# EAGLE design Massage_Pad_Peripheral_PCB_SplitPlane (EAGLE 9.3.1)
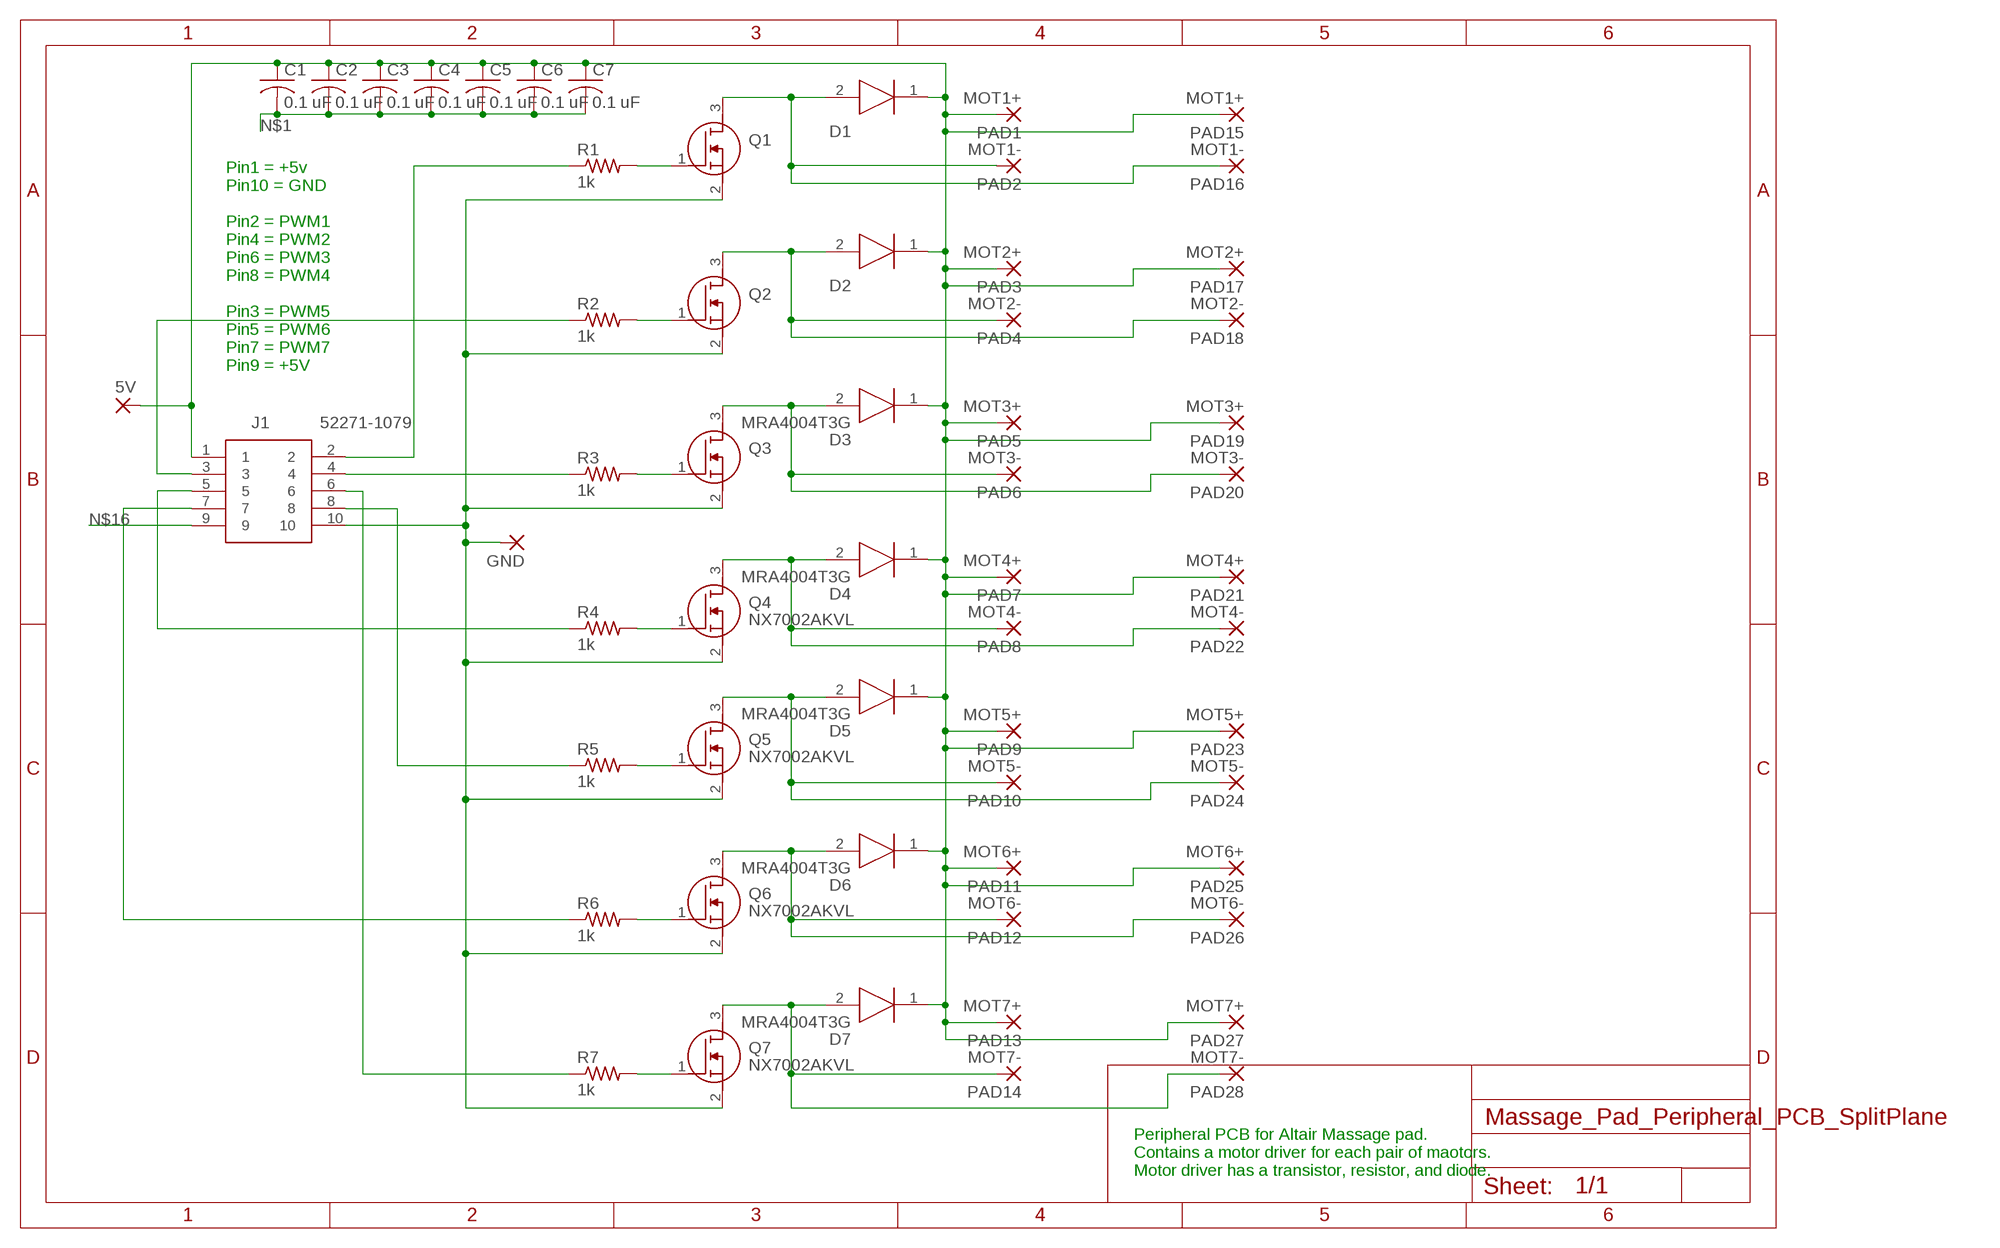
[diagram p0: schematic, sheet 1]

## Parts
5V  3,17/1,3  [3,17/1,3]
C1  0.1 uF  C-USC1808  [C1808]
C2  0.1 uF  C-USC1808  [C1808]
C3  0.1 uF  C-USC1808  [C1808]
C4  0.1 uF  C-USC1808  [C1808]
C5  0.1 uF  C-USC1808  [C1808]
C6  0.1 uF  C-USC1808  [C1808]
C7  0.1 uF  C-USC1808  [C1808]
D1  MRA4004T3G  [DIOM5226X220N]
D2  MRA4004T3G  [DIOM5226X220N]
D3  MRA4004T3G  [DIOM5226X220N]
D4  MRA4004T3G  [DIOM5226X220N]
D5  MRA4004T3G  [DIOM5226X220N]
D6  MRA4004T3G  [DIOM5226X220N]
D7  MRA4004T3G  [DIOM5226X220N]
GND  3,17/1,3  [3,17/1,3]
J1  52271-1079  [52271-1079]
PAD1  MOT1+  WIREPADSMD5-2,5  [5-2,5]
PAD2  MOT1-  WIREPADSMD5-2,5  [5-2,5]
PAD3  MOT2+  WIREPADSMD5-2,5  [5-2,5]
PAD4  MOT2-  WIREPADSMD5-2,5  [5-2,5]
PAD5  MOT3+  WIREPADSMD5-2,5  [5-2,5]
PAD6  MOT3-  WIREPADSMD5-2,5  [5-2,5]
PAD7  MOT4+  WIREPADSMD5-2,5  [5-2,5]
PAD8  MOT4-  WIREPADSMD5-2,5  [5-2,5]
PAD9  MOT5+  WIREPADSMD5-2,5  [5-2,5]
PAD10  MOT5-  WIREPADSMD5-2,5  [5-2,5]
PAD11  MOT6+  WIREPADSMD5-2,5  [5-2,5]
PAD12  MOT6-  WIREPADSMD5-2,5  [5-2,5]
PAD13  MOT7+  WIREPADSMD5-2,5  [5-2,5]
PAD14  MOT7-  WIREPADSMD5-2,5  [5-2,5]
PAD15  MOT1+  WIREPADSMD5-2,5  [5-2,5]
PAD16  MOT1-  WIREPADSMD5-2,5  [5-2,5]
PAD17  MOT2+  WIREPADSMD5-2,5  [5-2,5]
PAD18  MOT2-  WIREPADSMD5-2,5  [5-2,5]
PAD19  MOT3+  WIREPADSMD5-2,5  [5-2,5]
PAD20  MOT3-  WIREPADSMD5-2,5  [5-2,5]
PAD21  MOT4+  WIREPADSMD5-2,5  [5-2,5]
PAD22  MOT4-  WIREPADSMD5-2,5  [5-2,5]
PAD23  MOT5+  WIREPADSMD5-2,5  [5-2,5]
PAD24  MOT5-  WIREPADSMD5-2,5  [5-2,5]
PAD25  MOT6+  WIREPADSMD5-2,5  [5-2,5]
PAD26  MOT6-  WIREPADSMD5-2,5  [5-2,5]
PAD27  MOT7+  WIREPADSMD5-2,5  [5-2,5]
PAD28  MOT7-  WIREPADSMD5-2,5  [5-2,5]
Q1  NX7002AKVL  [SOT95P230X110-3N]
Q2  NX7002AKVL  [SOT95P230X110-3N]
Q3  NX7002AKVL  [SOT95P230X110-3N]
Q4  NX7002AKVL  [SOT95P230X110-3N]
Q5  NX7002AKVL  [SOT95P230X110-3N]
Q6  NX7002AKVL  [SOT95P230X110-3N]
Q7  NX7002AKVL  [SOT95P230X110-3N]
R1  1k  R-US_R1206  [R1206]
R2  1k  R-US_R1206  [R1206]
R3  1k  R-US_R1206  [R1206]
R4  1k  R-US_R1206  [R1206]
R5  1k  R-US_R1206  [R1206]
R6  1k  R-US_R1206  [R1206]
R7  1k  R-US_R1206  [R1206]

## Nets
N$1: C1.2 C2.2 C3.2 C4.2 C5.2 C6.2 C7.2 GND.1(P) J1.10 Q1.2(S) Q2.2(S) Q3.2(S) Q4.2(S) Q5.2(S) Q6.2(S) Q7.2(S)
N$2: Q1.1(G) R1.2
N$3: Q2.1(G) R2.2
N$4: Q3.1(G) R3.2
N$5: Q4.1(G) R4.2
N$6: Q5.1(G) R5.2
N$7: Q6.1(G) R6.2
N$8: Q7.1(G) R7.2
N$9: D7.2(A) PAD14.1(P) PAD28.1(P) Q7.3(D)
N$10: D6.2(A) PAD12.1(P) PAD26.1(P) Q6.3(D)
N$11: D5.2(A) PAD10.1(P) PAD24.1(P) Q5.3(D)
N$12: D3.2(A) PAD6.1(P) PAD20.1(P) Q3.3(D)
N$13: D4.2(A) PAD8.1(P) PAD22.1(P) Q4.3(D)
N$14: D2.2(A) PAD4.1(P) PAD18.1(P) Q2.3(D)
N$15\: D1.2(A) PAD2.1(P) PAD16.1(P) Q1.3(D)
N$16: 5V.1(P) C1.1 C2.1 C3.1 C4.1 C5.1 C6.1 C7.1 D1.1(K) D2.1(K) D3.1(K) D4.1(K) D5.1(K) D6.1(K) D7.1(K) J1.1 J1.9 PAD1.1(P) PAD3.1(P) PAD5.1(P) PAD7.1(P) PAD9.1(P) PAD11.1(P) PAD13.1(P) PAD15.1(P) PAD17.1(P) PAD19.1(P) PAD21.1(P) PAD23.1(P) PAD25.1(P) PAD27.1(P)
N$17: J1.2 R1.1
N$18: J1.3 R2.1
N$19: J1.4 R3.1
N$20: J1.5 R4.1
N$21: J1.8 R5.1
N$22: J1.7 R6.1
N$24: J1.6 R7.1

## Notes on the sheet
- Pin1 = +5v
  Pin10 = GND
  
  Pin2 = PWM1
  Pin4 = PWM2
  Pin6 = PWM3
  Pin8 = PWM4
  
  Pin3 = PWM5
  Pin5 = PWM6
  Pin7 = PWM7
  Pin9 = +5V
- Peripheral PCB for Altair Massage pad. 
  Contains a motor driver for each pair of maotors.
  Motor driver has a transistor, resistor, and diode.

## Library data of the parts
5V GND = wirepad:3,17/1,3: THROUGH-HOLE PAD
C1-C7 = rcl:C-US: CAPACITOR, American symbol; MANUFACTURER_NAME: Kemet; MANUFACTURER_PART_NUMBER: C1808C104K5RACTU; MOUSER_PART_NUMBER: 80-C1808C104K5R; SPICEPREFIX: C
D1-D7 = MRA4004T3G:MRA4004T3G: Rectifier diode,MRA4004 1A 400V ON Semi MRA4004T3G, SMT Switching Diode, 400V 1A, 2-Pin DO-214AC Source: Datasheet <http://www.onsemi.com/pub/Collateral/MRA4003T3-D.PDF>; ALLIED_NUMBER: 70340468; ALLIED_PRICE-STOCK: http://www.alliedelec.com/on-semiconductor-mra4004t3g/70340468/; DESCRIPTION: Rectifier diode,MRA4004 1A 400V ON Semi MRA4004T3G, SMT Switching Diode, 400V 1A, 2-Pin DO-214AC; HEIGHT: 2.2mm; MANUFACTURER_NAME: ON Semiconductor; MANUFACTURER_PART_NUMBER: MRA4004T3G; MOUSER_PART_NUMBER: 863-MRA4004T3G; MOUSER_PRICE-STOCK: https://www.mouser.com/Search/Refine.aspx?Keyword=863-MRA4004T3G; RS_PART_NUMBER: 6490904; RS_PRICE-STOCK: http://uk.rs-online.com/web/p/products/6490904
J1 = 52271-1079:52271-1079: 1.0MM FPC R/A CONN 10 W Molex FFC/FPC SMT Series 1mm Pitch 10 Way Right Angle SMT Female FPC Connector, ZIF Bottom Contact Source: Datasheet <http://www.molex.com/webdocs/datasheets/pdf/en-us//0522711079_FFC_FPC_CONNECTORS.pdf>; ALLIED_NUMBER: 70373119; ALLIED_PRICE-STOCK: https://www.alliedelec.com/molex-incorporated-52271-1079/70373119/; DESCRIPTION: 1.0MM FPC R/A CONN 10 W Molex FFC/FPC SMT Series 1mm Pitch 10 Way Right Angle SMT Female FPC Connector, ZIF Bottom Contact; HEIGHT: mm; MANUFACTURER_NAME: Molex; MANUFACTURER_PART_NUMBER: 52271-1079; MOUSER_PART_NUMBER: 538-52271-1079; MOUSER_PRICE-STOCK: https://www.mouser.com/Search/Refine.aspx?Keyword=538-52271-1079; RS_PART_NUMBER: 5144329P; RS_PRICE-STOCK: http://uk.rs-online.com/web/p/products/5144329P
PAD1-PAD28 = wirepad:WIREPAD: Wire PAD connect wire on PCB
Q1-Q7 = SamacSys_Parts:NX7002AKVL: Trans MOSFET N-CH 60V 0.19A 3-Pin TO-236AB Source: Datasheet <https://www.arrow.com/en/products/nx7002akvl/nexperia>; DESCRIPTION: Trans MOSFET N-CH 60V 0.19A 3-Pin TO-236AB; HEIGHT: 1.1mm; MANUFACTURER_NAME: Nexperia; MANUFACTURER_PART_NUMBER: NX7002AKVL; MOUSER_PART_NUMBER: 771-NX7002AKVL; MOUSER_PRICE-STOCK: https://www.mouser.com/Search/Refine.aspx?Keyword=771-NX7002AKVL
R1 = rcl:R-US_: RESISTOR, American symbol; MANUFACTURER_NAME: Bourns; MANUFACTURER_PART_NUMBER: CR1206-FX-1001ELF; MOUSER_PART_NUMBER: 652-CR1206FX-1001ELF; SPICEPREFIX: R
R2-R7 = rcl:R-US_: RESISTOR, American symbol; SPICEPREFIX: R

## Net classes
1 signal: width 0.254 mm, drill 0.254 mm, clearance 0.254 mm

## Board
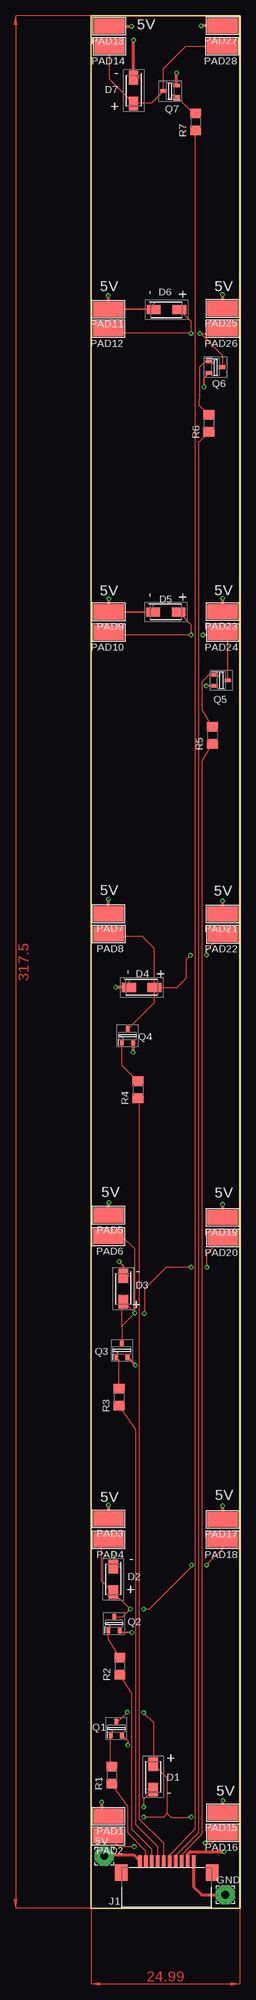
[diagram p1: board, top side]
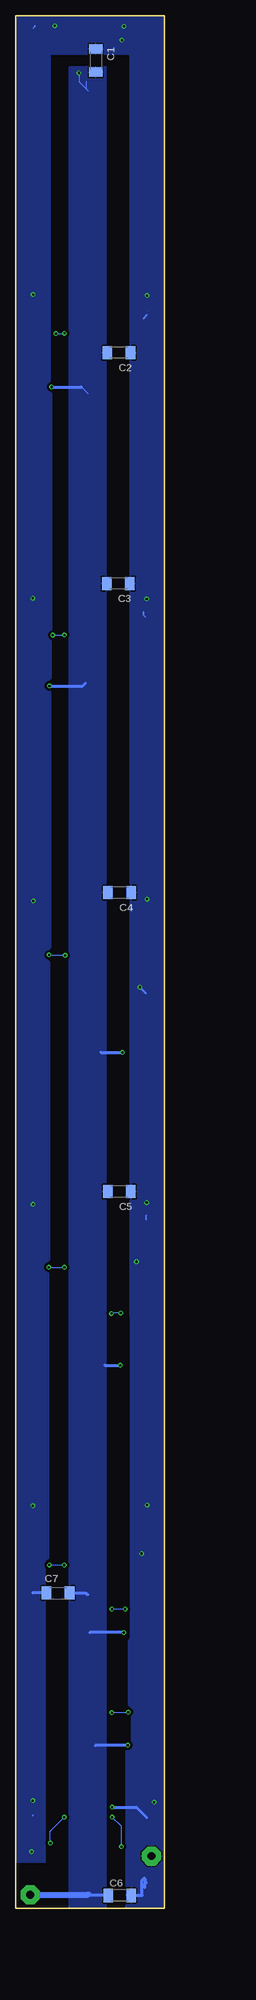
[diagram p2: board, bottom side, seen from below]

Size 25.01 x 317.5 mm. Coordinates in mm from the lower left corner, seen from the top.
Outline: 0,0 0,317.5 25.01,317.5 25.01,317.5 25.01,0 0,0 0,0
Copper layers (1*16): Top 0.1mm / dielectric 0.308mm / Bottom 0.1mm
Design rules "default *": minimum track width 6mil, minimum drill 0.35mm, track to track 6mil, track to pad 6mil, pad to pad 6mil, via to via 6mil, smd to smd 6mil, copper to edge 0mil, drill to drill 6mil, minimum pad ring 10mil, minimum via ring 8mil, stop-mask expansion 4mil, vias tented up to drill 0mil, thermal gap 10mil

### Footprints (pad centres in the part's own frame; a part is rotated, then mirrored left to right if it is on the bottom)
3,17/1,3 = drill 1.321 pad 3.175 octagon: 1 0,0
C1808 = smd 1.6 x 2.2: 1 -1.95,0; 2 1.95,0
DIOM5226X220N = smd 2.3 x 1.55: 1 -2.15,0; 2 2.15,0
52271-1079 = smd 0.6 x 1.9: 1 -4.5,1.1; 2 -3.5,1.1; 3 -2.5,1.1; 4 -1.5,1.1; 5 -0.5,1.1; 6 0.5,1.1; 7 1.5,1.1; 8 2.5,1.1; 9 3.5,1.1; 10 4.5,1.1 | smd 2.1 x 2.8: 11 7.65,-0.85; 12 -7.65,-0.85
5-2,5 = smd 2.54 x 5.08: 1 0,0
SOT95P230X110-3N = smd 1.05 x 0.6: 1 -1.1,0.95; 2 -1.1,-0.95; 3 1.1,0
R1206 = smd 1.6 x 1.803: 1 -1.422,0; 2 1.422,0

### Placement (x,y rotation side)
5V  2.19,8.73 0 top
C1  11.53,309.99 270 bottom
C2  7.64,260.95 180 bottom
C3  7.76,222.23 180 bottom
C4  7.52,170.37 180 bottom
C5  7.57,120.22 180 bottom
C6  7.5,2.13 180 bottom
C7  17.88,52.88 0 bottom
D1  10.42,22.04 90 top
D2  3.7,55.16 270 top
D3  5.4,103.91 270 top
D4  8.49,154.46 0 top
D5  12.55,217.45 0 top
D6  12.67,268.17 0 top
D7  7.12,304.93 270 top
GND  22.54,2.25 0 top
J1  12.7,6.83 0 top
PAD1  2.9,15.39 90 top
PAD2  2.89,12.11 90 top
PAD3  2.92,65.33 90 top
PAD4  2.9,61.78 90 top
PAD5  2.92,116.25 90 top
PAD6  2.88,112.67 90 top
PAD7  2.92,166.82 90 top
PAD8  2.93,163.42 90 top
PAD9  2.96,217.47 90 top
PAD10  2.97,214 90 top
PAD11  2.89,268.25 90 top
PAD12  2.88,264.97 90 top
PAD13  3.05,315.73 90 top
PAD14  3.08,312.37 90 top
PAD15  22.12,15.98 90 top
PAD16  22.12,12.66 90 top
PAD17  22.09,65.23 90 top
PAD18  22.09,61.76 90 top
PAD19  22.09,115.88 90 top
PAD20  22.12,112.44 90 top
PAD21  22.08,166.8 90 top
PAD22  22.13,163.39 90 top
PAD23  22.09,217.53 90 top
PAD24  22.11,213.99 90 top
PAD25  22.09,268.39 90 top
PAD26  22.09,264.97 90 top
PAD27  22.05,315.8 90 top
PAD28  22.01,312.35 90 top
Q1  4.22,30.12 90 top
Q2  3.84,47.73 90 top
Q3  5.15,93.58 90 top
Q4  6.11,146.34 90 top
Q5  21.85,205.99 0 top
Q6  20.91,258.53 0 top
Q7  13.26,304.83 180 top
R1  3.45,22.31 90 top
R2  4.79,40.63 90 top
R3  4.69,85.73 90 top
R4  7.85,137.3 90 top
R5  20.37,196.77 90 top
R6  19.78,249.07 90 top
R7  17.56,299.66 90 top

### Tracks (layer width: path | path; a pad name or v marks a point on that pad's centre or on a via)
N$1  (via drill 0.35)
  Top 0.152: 14.36,307.73 v14.36,307.89 | 14.36,307.73 | Q5.2 | Q4.2 | 7.41,91.17 v7.41,91.07 | Q1.2 6.15,28.04 v6.15,27.32
  Top 0.254: J1.10 17.29,8.01 | 22.52,2.27 GND.1 | v6.82,46.23 5.19,46.23 Q2.2 | Q6.2 18.95,256.73 v18.95,255.22
  Top 0.305: Q5.2 v19.32,205.04
  Top 0.508: Q7.2 14.36,307.73 | Q4.2 v7.05,143.59 | Q3.2 7.41,91.17 | J1.10 17.2,3.61 18.57,2.23 18.59,2.25 GND.1
  Bottom 0.203: v14.36,307.89 14.36,306.46 13.09,305.19 | 12.7,304.8 13.09,305.19 | 13.09,305.19 13.09,306.5 | 13.92,255.22 13.33,254.63 | 12.7,254 13.33,254.63 | 13.33,254.63 13.35,254.63
  Bottom 0.254: v7.06,143.58 v7.05,143.59
  Bottom 0.508: 10,91.07 v7.41,91.07 | 10.67,143.58 v7.06,143.58 | v18.95,255.22 13.92,255.22 | v6.15,27.32 11.55,27.32 11.56,27.31 | v19.32,205.04 13.71,205.04 13.26,205.5 | v6.82,46.23 12.5,46.23 | C6.2 12.71,2.13 12.83,2.25 | C7.2 13.18,52.88 12.88,52.58
  Bottom 0.813: 12.83,2.25 12.71,2.37
  Bottom 1.016: GND.1 12.83,2.25
  pour Bottom (isolate 0.406): 9.71,308.91 15.93,308.91 16.07,308.78 16.07,0.02 16.05,0.01 12.7,0.01 9.71,0.01 9.69,0.02 9.71,0.02
N$2
  Top 0.203: R1.2 3.27,24.91 Q1.1
N$3
  Top 0.203: R2.2 2.89,45.13 Q2.1
N$4
  Top 0.203: Q3.1 4.2,92.37 4.69,91.89 R3.2
N$5
  Top 0.203: R4.2 5.16,141.42 Q4.1
N$6
  Top 0.203: Q5.1 19.83,206.94 18.62,205.73 18.62,201.11 R5.2
N$7
  Top 0.203: Q6.1 19.17,259.48 18.19,258.51 18.19,253.51 18.19,253.25 18.19,252.07 R6.2
N$8
  Top 0.203: R7.2 16.64,301.61 Q7.1
N$9
  Top 0.203: PAD14.1 3.08,306.82 D7.2 10.1,302.78 Q7.3 12.16,308.6 15.92,312.36 22,312.36 PAD28.1
N$10  (via drill 0.35)
  Top 0.203: PAD26.1 21.27,264.16 v18.23,264.16 18.39,264.16 22.01,260.54 Q6.3 | D6.2 16.77,266.22 v16.77,264.21 3.64,264.21 PAD12.1
  Bottom 0.203: v18.23,264.16 16.71,264.16 v16.77,264.21
N$11  (via drill 0.35)
  Top 0.203: 20.4,213.58 v18.77,213.58 21.7,213.58 PAD24.1 22.95,213.15 Q5.3 | D5.2 16.77,215.38 v16.77,213.59 3.37,213.59 PAD10.1
  Bottom 0.203: v18.77,213.58 16.75,213.58 v16.77,213.59
N$12  (via drill 0.35)
  Top 0.152: v7.32,99.84 5.15,97.66
  Top 0.203: Q3.3 5.15,97.66 5.15,101.51 D3.2 v7.32,99.84 7.32,110.56 5.22,112.66 PAD6.1 | v16.81,107.52 12.57,107.52 8.91,103.87 v8.91,99.77 | v19.44,107.52 19.44,109.76 PAD20.1
  Bottom 0.203: v8.91,99.77 8.85,99.84 v7.32,99.84 | v16.81,107.52 16.84,107.49 19.51,107.49 19.49,107.47 v19.44,107.52
N$13  (via drill 0.35)
  Top 0.152: Q4.3 6.14,147.48
  Top 0.203: v19.37,159.92 19.37,160.63 PAD22.1 | Q4.3 10.64,151.97 D4.2 | D4.2 10.64,161.02 8.62,163.03 3.32,163.03 PAD8.1 | D4.2 14.43,154.46 15.93,155.96 15.93,159.08 v16.68,159.83
  Bottom 0.203: v16.68,159.83 16.9,159.83 19.28,159.83 v19.37,159.92
N$14  (via drill 0.35)
  Top 0.152: v16.83,57.54 16.83,57.23 16.7,57.1
  Top 0.203: PAD4.1 1.69,60.57 | v8.8,50.18 9.78,50.18 16.7,57.1 | v19.36,57.58 22.09,60.31 PAD18.1 | 1.69,61.64 1.69,55.02 D2.2 6.54,50.17 v6.58,50.17 5.24,48.83 Q2.3
  Top 0.508: PAD4.1 1.83,61.78 1.69,61.64
  Bottom 0.152: v19.36,57.58 19.35,57.58
  Bottom 0.203: v16.83,57.54 16.87,57.58 19.35,57.58 | v8.8,50.18 v8.8,50.17 v6.58,50.17
N$15\  (via drill 0.35)
  Top 0.203: v6.07,32.88 4.42,31.22 Q1.3 | v8.8,32.8 10.42,31.18 D1.2 12.73,21.88 12.73,15.88 | v19.16,10.89 20.36,10.89 PAD16.1 | v7.23,10.32 4.68,10.32 PAD2.1 | 12.73,15.88 13.36,15.24 v16.81,15.24 | 12.73,15.88 12.1,15.25 v8.78,15.25
  Bottom 0.203: v19.16,10.89 19.16,12.9 v16.81,15.24 | v8.8,32.8 8.72,32.88 v6.07,32.88 | v7.23,10.32 7.23,13.7 v8.78,15.25
N$16  (via drill 0.35)
  Top 0.152: 1.74,64.15 PAD3.1 | 2.68,315.36 PAD13.1 4.79,315.73 | 22.21,217.65 PAD23.1 | 22.09,166.81 PAD21.1 | 22.08,115.89 PAD19.1 | PAD11.1 2.96,268.18 | PAD25.1 22.21,268.28 | PAD7.1 3.09,166.66 | v7.12,313.41 v7.13,313.41 | 4.14,154.46 v4.1,154.5 | v3.82,59.47 3.82,57.44 D2.1 | D1.1 8.79,18.26 v8.79,16.95
  Top 0.203: 1.74,16.55 PAD1.1 | D5.1 | 10.43,268.25 D6.1
  Top 0.254: 5V.1 2.31,8.85 | D3.1 5.4,107.74 v4.69,108.46 | 22.09,65.22 PAD17.1 | 3.48,217.47 PAD9.1 7.35,217.46 D5.1 | PAD5.1 3.03,116.25 | PAD27.1 21.81,315.8 | PAD11.1 10.43,268.25
  Top 0.508: J1.1 7.28,8.85 2.31,8.85 | D7.1 v7.12,313.41 | D4.1 4.14,154.46 | v1.74,17.78 1.74,16.55 | PAD15.1 v22.12,18.03 | v22.11,67.49 22.09,67.49 PAD17.1 | v2.91,67.65 2.9,65.36 PAD3.1 | v2.96,118.39 2.92,118.39 PAD5.1 | PAD19.1 22.09,118.07 v22.07,118.09 | PAD21.1 22.08,168.98 v22.04,168.98 | PAD7.1 v2.9,169.27 | PAD9.1 v2.96,219.65 | v22.1,219.78 22.09,219.78 PAD23.1 | PAD25.1 22.09,270.31 v22.07,270.7 | v2.9,270.54 2.89,270.54 PAD11.1 | v6.8,315.71 6.79,315.73 PAD13.1 | PAD27.1 18.43,315.8 v18.43,315.81 | J1.9 16.2,9 16.67,9.47 v22.33,9.47
  Bottom 0.152: 2.92,115.4 3.09,115.56 | 3.09,216.55 3.5,216.96 | 21.74,315.73 22.17,315.3 | 22.09,15.55 22.24,15.4 | 2.69,268.05 2.68,268.05 | 1.75,16.57 1.74,16.57
  Bottom 0.203: v1.74,17.77 v1.74,17.78
  Bottom 0.254: 3.09,115.56 3.09,116.2 3.03,116.25 | 3.5,216.96 3.5,217.49 3.48,217.47 | 3.5,266.7 2.89,267.31 | v4.1,154.5 3.09,153.48 | 22.12,15.59 22.09,15.55 | 21.81,315.8 21.74,315.73
  Bottom 0.508: v8.79,16.95 4.71,16.95 2.94,15.18 | C6.1 4.52,2.13 4.48,2.17 3.81,2.17 3.76,2.11 3.76,4.64 3.38,5.01 3.28,4.91 3.28,4.03 | 3.28,3.47 3.28,4.03 | 3.28,4.03 3.01,4.3 | C7.1 22.07,52.88 22.09,52.9
  pour Bottom (isolate 0.406): 0,0 0,317.5 24.96,317.5 24.96,7.69 19.96,7.69 20.01,7.74 20.01,58.22 19.44,58.79 19.44,106.5 20.14,107.2 20.14,108.03 19.31,108.86 19.31,158.67 20.09,159.44 20.06,159.44 20.06,160.18 19.09,161.14 19.09,204.06 20.1,205.06 20.1,205.39 19.01,206.48 19.01,212.54 19.58,213.11 19.58,213.85 18.92,214.51 18.92,254.08 19.88,255.04 19.88,255.61 19.18,256.31 19.18,310.97 19.09,311.06 5.91,311.06 5.74,310.88 5.74,99.25 5.73,99.24 5.73,45.15 6,44.89 6,34.15 5.51,33.65 5.51,27.2 6.44,26.27 6.44,-0.01 6.4,-0.05 0.05,-0.05
N$17
  Top 0.203: J1.2 9.2,9.57 6.17,12.6 6.17,16.99 R1.1
N$18
  Top 0.203: J1.3 10.2,9.89 6.82,13.27 6.82,36 R2.1
N$19
  Top 0.203: J1.4 11.2,10.3 7.54,13.95 7.54,80.27 R3.1
N$20
  Top 0.203: J1.5 12.2,10.85 8.11,14.94 8.11,135.51 R4.1
N$21
  Top 0.203: J1.8 15.2,8.95 18.71,12.46 18.71,192.51 R5.1
N$22
  Top 0.203: J1.7 14.2,8.85 18.11,12.76 18.11,241.3 18.11,244.8 18.11,245.91 19.69,247.49 R6.1
N$24
  Top 0.203: J1.6 13.2,8.99 17.51,13.3 17.51,298.17 R7.1
(copper drawn outside any net)
  shapes: Top area x2

### Text on the board
tPlace: 5V | - | + | 5V | - | + | 5V | 5V | - | + | 5V | 5V | 5V | - | + | 5V | 5V | - | + | 5V | 5V | - | + | + | - | 5V